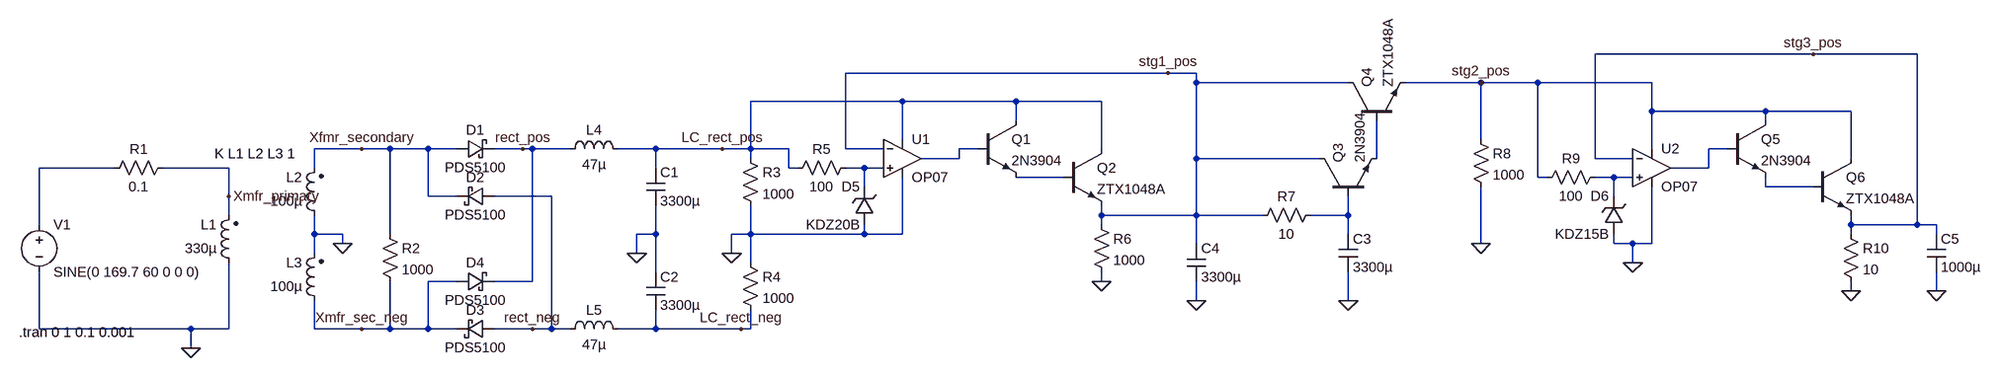
[diagram p0: schematic Power Supply.asc]
Power Supply.asc, the LTspice schematic file:
Version 4
SHEET 1 3136 680
WIRE 2848 -64 2480 -64
WIRE 3024 -64 2848 -64
WIRE 1760 -32 1216 -32
WIRE 1808 -32 1760 -32
WIRE 1808 -16 1808 -32
WIRE 2064 -16 1808 -16
WIRE 2288 -16 2160 -16
WIRE 2384 -16 2288 -16
WIRE 2576 -16 2384 -16
WIRE 1312 16 1056 16
WIRE 1504 16 1312 16
WIRE 1648 16 1504 16
WIRE 2576 32 2576 -16
WIRE 2768 32 2576 32
WIRE 2912 32 2768 32
WIRE 1504 48 1504 16
WIRE 2768 48 2768 32
WIRE 1312 80 1312 16
WIRE 2288 80 2288 -16
WIRE 400 96 320 96
WIRE 448 96 400 96
WIRE 512 96 448 96
WIRE 560 96 512 96
WIRE 672 96 624 96
WIRE 688 96 672 96
WIRE 752 96 688 96
WIRE 896 96 832 96
WIRE 1008 96 896 96
WIRE 1056 96 1056 16
WIRE 1056 96 1008 96
WIRE 1120 96 1056 96
WIRE 1216 96 1216 -32
WIRE 1280 96 1216 96
WIRE 1440 96 1408 96
WIRE 1648 96 1648 16
WIRE 2576 96 2576 32
WIRE 2704 96 2672 96
WIRE 1056 112 1056 96
WIRE 1408 112 1408 96
WIRE 1408 112 1344 112
WIRE 1808 112 1808 -16
WIRE 2016 112 1808 112
WIRE 2112 112 2112 48
WIRE 2480 112 2480 -64
WIRE 2544 112 2480 112
WIRE 2912 112 2912 32
WIRE -16 128 -144 128
WIRE 176 128 64 128
WIRE 320 128 320 96
WIRE 896 128 896 96
WIRE 1120 128 1120 96
WIRE 1136 128 1120 128
WIRE 1248 128 1216 128
WIRE 1280 128 1248 128
WIRE 2672 128 2672 96
WIRE 2672 128 2608 128
WIRE 1584 144 1504 144
WIRE 2384 144 2384 -16
WIRE 2400 144 2384 144
WIRE 2512 144 2480 144
WIRE 2544 144 2512 144
WIRE 1248 160 1248 128
WIRE 2768 160 2768 144
WIRE 2848 160 2768 160
WIRE 176 176 176 128
WIRE 512 176 512 96
WIRE 560 176 512 176
WIRE 720 176 624 176
WIRE 2512 176 2512 144
WIRE 176 208 176 176
WIRE 1648 208 1648 192
WIRE 1808 208 1808 112
WIRE 1808 208 1648 208
WIRE 1920 208 1808 208
WIRE 2064 208 2064 176
WIRE 2064 208 2000 208
WIRE -144 224 -144 128
WIRE 1648 224 1648 208
WIRE 2912 224 2912 208
WIRE 3024 224 3024 -64
WIRE 3024 224 2912 224
WIRE 3056 224 3024 224
WIRE 320 240 320 208
WIRE 368 240 320 240
WIRE 448 240 448 96
WIRE 896 240 896 192
WIRE 896 240 864 240
WIRE 1056 240 1056 192
WIRE 1056 240 1024 240
WIRE 1248 240 1248 224
WIRE 1248 240 1056 240
WIRE 1312 240 1312 144
WIRE 1312 240 1248 240
WIRE 2064 240 2064 208
WIRE 2912 240 2912 224
WIRE 3056 240 3056 224
WIRE 368 256 368 240
WIRE 1808 256 1808 208
WIRE 2288 256 2288 160
WIRE 2512 256 2512 240
WIRE 2544 256 2512 256
WIRE 2576 256 2576 160
WIRE 2576 256 2544 256
WIRE 320 272 320 240
WIRE 864 272 864 240
WIRE 1024 272 1024 240
WIRE 1056 288 1056 240
WIRE 2544 288 2544 256
WIRE 896 304 896 240
WIRE 560 320 512 320
WIRE 688 320 688 96
WIRE 688 320 624 320
WIRE 1648 320 1648 304
WIRE 2912 336 2912 320
WIRE 3056 336 3056 304
WIRE 1808 352 1808 320
WIRE 2064 352 2064 304
WIRE -144 400 -144 304
WIRE 112 400 -144 400
WIRE 176 400 176 288
WIRE 176 400 112 400
WIRE 320 400 320 352
WIRE 400 400 320 400
WIRE 448 400 448 320
WIRE 448 400 400 400
WIRE 512 400 512 320
WIRE 512 400 448 400
WIRE 560 400 512 400
WIRE 688 400 624 400
WIRE 720 400 720 176
WIRE 720 400 688 400
WIRE 752 400 720 400
WIRE 896 400 896 368
WIRE 896 400 832 400
WIRE 1040 400 896 400
WIRE 1056 400 1056 368
WIRE 1056 400 1040 400
WIRE 112 432 112 400
FLAG 368 256 0
FLAG 112 432 0
FLAG 864 272 0
FLAG 176 176 Xmfr_primary
FLAG 400 96 Xfmr_secondary
FLAG 400 400 Xmfr_sec_neg
FLAG 688 400 rect_neg
FLAG 672 96 rect_pos
FLAG 1008 96 LC_rect_pos
FLAG 1040 400 LC_rect_neg
FLAG 1024 272 0
FLAG 1648 320 0
FLAG 2064 352 0
FLAG 2288 256 0
FLAG 1760 -32 stg1_pos
FLAG 2288 -16 stg2_pos
FLAG 2912 336 0
FLAG 2544 288 0
FLAG 2848 -64 stg3_pos
FLAG 1808 352 0
FLAG 3056 336 0
SYMBOL res 80 112 R90
WINDOW 0 0 56 VBottom 2
WINDOW 3 32 56 VTop 2
SYMATTR InstName R1
SYMATTR Value 0.1
SYMBOL voltage -144 208 R0
WINDOW 123 0 0 Left 2
WINDOW 39 0 0 Left 2
SYMATTR InstName V1
SYMATTR Value SINE(0 169.7 60 0 0 0)
SYMBOL res 432 224 R0
SYMATTR InstName R2
SYMATTR Value 1000
SYMBOL ind2 192 304 R180
WINDOW 0 36 80 Left 2
WINDOW 3 36 40 Left 2
SYMATTR InstName L1
SYMATTR Value 330µ
SYMATTR Type ind
SYMBOL ind2 336 224 R180
WINDOW 0 36 80 Left 2
WINDOW 3 36 40 Left 2
SYMATTR InstName L2
SYMATTR Value 100µ
SYMATTR Type ind
SYMBOL ind2 336 368 R180
WINDOW 0 36 80 Left 2
WINDOW 3 36 40 Left 2
SYMATTR InstName L3
SYMATTR Value 100µ
SYMATTR Type ind
SYMBOL schottky 560 112 R270
WINDOW 0 32 32 VTop 2
WINDOW 3 0 32 VBottom 2
SYMATTR InstName D1
SYMATTR Value PDS5100
SYMATTR Description Diode
SYMATTR Type diode
SYMBOL schottky 624 160 R90
WINDOW 0 0 32 VBottom 2
WINDOW 3 32 32 VTop 2
SYMATTR InstName D2
SYMATTR Value PDS5100
SYMATTR Description Diode
SYMATTR Type diode
SYMBOL schottky 624 384 R90
WINDOW 0 0 32 VBottom 2
WINDOW 3 32 32 VTop 2
SYMATTR InstName D3
SYMATTR Value PDS5100
SYMATTR Description Diode
SYMATTR Type diode
SYMBOL schottky 560 336 R270
WINDOW 0 32 32 VTop 2
WINDOW 3 0 32 VBottom 2
SYMATTR InstName D4
SYMATTR Value PDS5100
SYMATTR Description Diode
SYMATTR Type diode
SYMBOL cap 880 128 R0
SYMATTR InstName C1
SYMATTR Value 3300µ
SYMBOL cap 880 304 R0
SYMATTR InstName C2
SYMATTR Value 3300µ
SYMBOL ind 736 112 R270
WINDOW 0 32 56 VTop 2
WINDOW 3 5 56 VBottom 2
SYMATTR InstName L4
SYMATTR Value 47µ
SYMBOL ind 736 416 R270
WINDOW 0 32 56 VTop 2
WINDOW 3 5 56 VBottom 2
SYMATTR InstName L5
SYMATTR Value 47µ
SYMBOL res 1040 96 R0
SYMATTR InstName R3
SYMATTR Value 1000
SYMBOL res 1040 272 R0
SYMATTR InstName R4
SYMATTR Value 1000
SYMBOL Opamps\\OP07 1312 48 R0
SYMATTR InstName U1
SYMBOL res 1232 112 R90
WINDOW 0 0 56 VBottom 2
WINDOW 3 32 56 VTop 2
SYMATTR InstName R5
SYMATTR Value 100
SYMBOL zener 1264 224 R180
WINDOW 0 24 64 Left 2
WINDOW 3 24 0 Left 2
SYMATTR InstName D5
SYMATTR Value KDZ20B
SYMATTR Description Diode
SYMATTR Type diode
SYMBOL res 1632 208 R0
SYMATTR InstName R6
SYMATTR Value 1000
SYMBOL npn 1440 48 R0
SYMATTR InstName Q1
SYMATTR Value 2N3904
SYMBOL npn 1584 96 R0
SYMATTR InstName Q2
SYMATTR Value ZTX1048A
SYMBOL res 2016 192 R90
WINDOW 0 0 56 VBottom 2
WINDOW 3 32 56 VTop 2
SYMATTR InstName R7
SYMATTR Value 10
SYMBOL cap 2048 240 R0
SYMATTR InstName C3
SYMATTR Value 3300µ
SYMBOL npn 2016 176 R270
SYMATTR InstName Q3
SYMATTR Value 2N3904
SYMBOL npn 2064 48 R270
SYMATTR InstName Q4
SYMATTR Value ZTX1048A
SYMBOL res 2272 64 R0
SYMATTR InstName R8
SYMATTR Value 1000
SYMBOL Opamps\\OP07 2576 64 R0
SYMATTR InstName U2
SYMBOL res 2496 128 R90
WINDOW 0 0 56 VBottom 2
WINDOW 3 32 56 VTop 2
SYMATTR InstName R9
SYMATTR Value 100
SYMBOL zener 2528 240 R180
WINDOW 0 24 64 Left 2
WINDOW 3 24 0 Left 2
SYMATTR InstName D6
SYMATTR Value KDZ15B
SYMATTR Description Diode
SYMATTR Type diode
SYMBOL res 2896 224 R0
SYMATTR InstName R10
SYMATTR Value 10
SYMBOL npn 2704 48 R0
SYMATTR InstName Q5
SYMATTR Value 2N3904
SYMBOL npn 2848 112 R0
SYMATTR InstName Q6
SYMATTR Value ZTX1048A
SYMBOL cap 1792 256 R0
SYMATTR InstName C4
SYMATTR Value 3300µ
SYMBOL cap 3040 240 R0
SYMATTR InstName C5
SYMATTR Value 1000µ
TEXT 152 104 Left 2 !K L1 L2 L3 1
TEXT -178 406 Left 2 !.tran 0 1 0.1 0.001

The netlist it stands for:
* Power Supply.asc
R1 Xmfr_primary N004 0.1
V1 N004 0 SINE(0 169.7 60 0 0 0)
R2 Xfmr_secondary Xmfr_sec_neg 1000
L1 0 Xmfr_primary 330µ
L2 0 Xfmr_secondary 100µ
L3 Xmfr_sec_neg 0 100µ
D1 Xfmr_secondary rect_pos PDS5100
D2 rect_neg Xfmr_secondary PDS5100
D3 rect_neg Xmfr_sec_neg PDS5100
D4 Xmfr_sec_neg rect_pos PDS5100
C1 LC_rect_pos 0 3300µ
C2 0 LC_rect_neg 3300µ
L4 rect_pos LC_rect_pos 47µ
L5 rect_neg LC_rect_neg 47µ
R3 LC_rect_pos 0 1000
R4 0 LC_rect_neg 1000
XU1 N005 stg1_pos LC_rect_pos 0 N001 LT1001  ; OP07, pins In+ In- V+ V- OUT
R5 N005 LC_rect_pos 100
D5 0 N005 KDZ20B
R6 stg1_pos 0 1000
Q1 LC_rect_pos N001 N006 0 2N3904
Q2 LC_rect_pos N006 stg1_pos 0 ZTX1048A
R7 N009 stg1_pos 10
C3 N009 0 3300µ
Q3 stg1_pos N009 N003 0 2N3904
Q4 stg1_pos N003 stg2_pos 0 ZTX1048A
R8 stg2_pos 0 1000
XU2 N007 stg3_pos stg2_pos 0 N002 LT1001  ; OP07, pins In+ In- V+ V- OUT
R9 N007 stg2_pos 100
D6 0 N007 KDZ15B
R10 stg3_pos 0 10
Q5 stg2_pos N002 N008 0 2N3904
Q6 stg2_pos N008 stg3_pos 0 ZTX1048A
C4 stg1_pos 0 3300µ
C5 stg3_pos 0 1000µ
.model D D
.lib standard.dio
.model NPN NPN
.model PNP PNP
.lib standard.bjt
K L1 L2 L3 1
.tran 0 1 0.1 0.001
.lib LTC.lib
.backanno
.end